# EasyEDA Pro project backup.epro, schematic SCH_3
Create Date: 2024-03-24; Page Name: P1; Project Name: ip2366; Schematic Name: SCH_3; Update Date: 2024-05-07; Drawed: luq; Page Size: A4; Version: V4.0
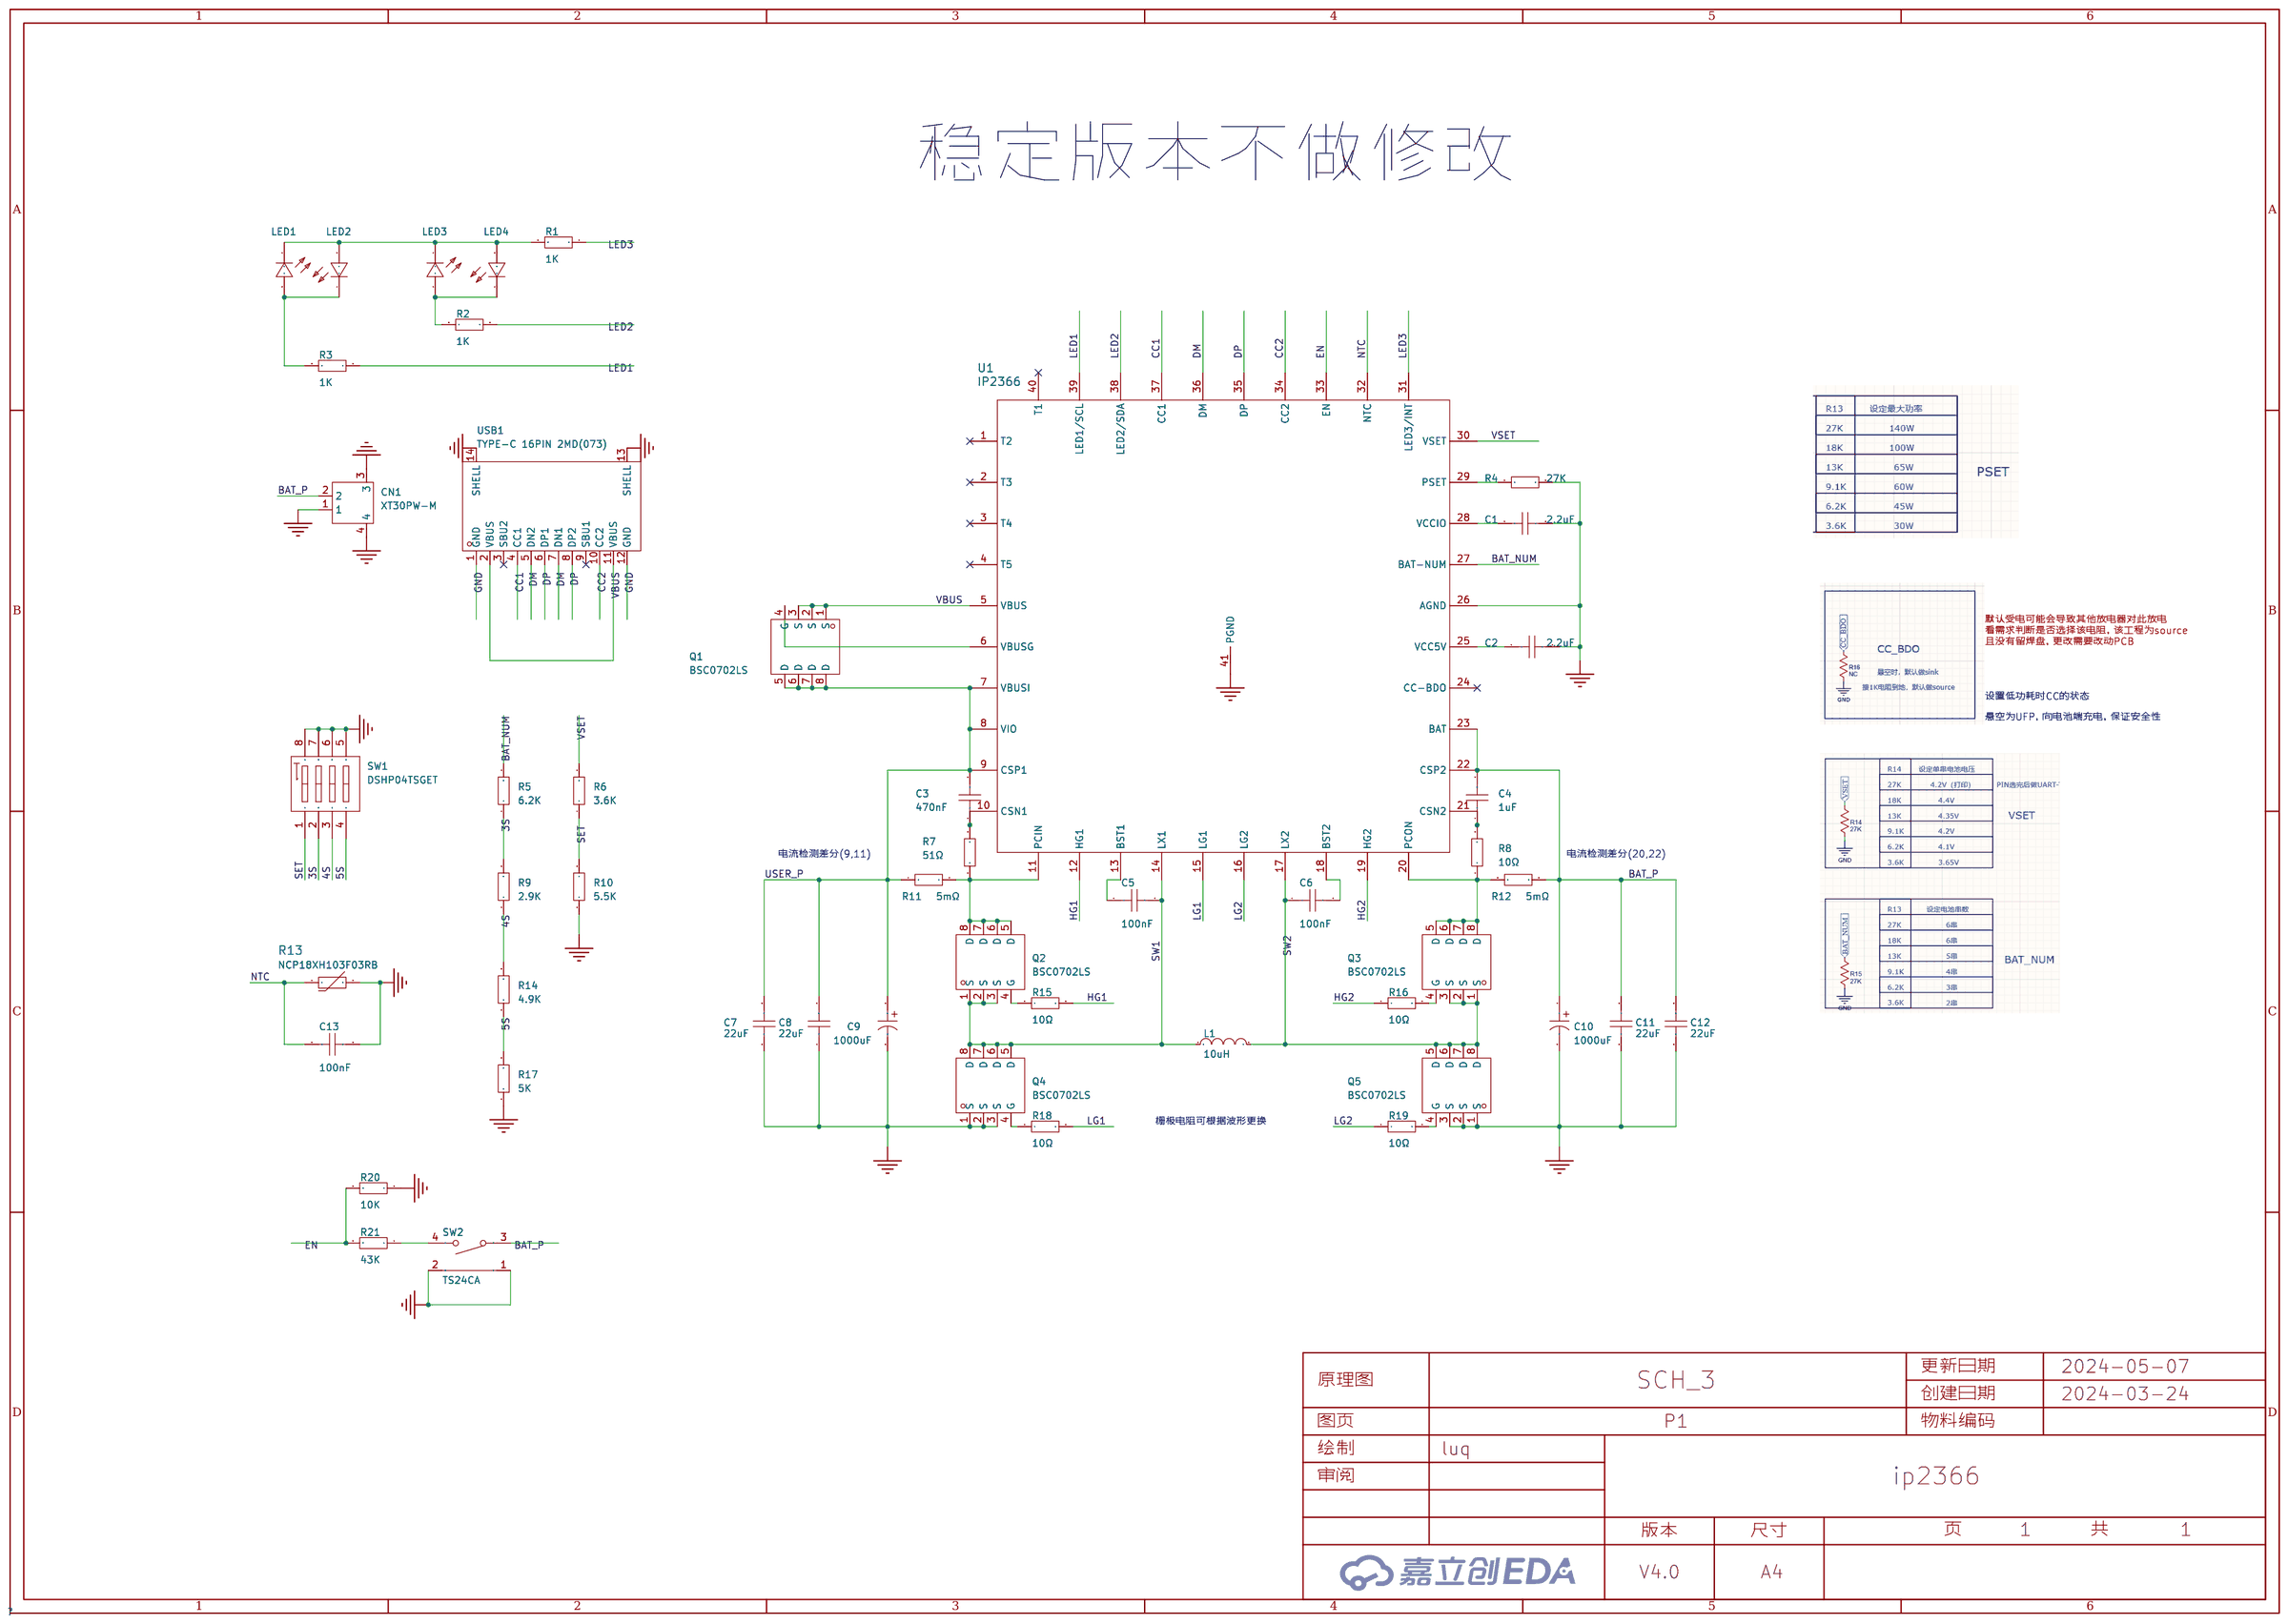
[diagram p3: schematic sheet]

## Parts
C1  2.2uF  [C0603]
C2  2.2uF  [C0603]
C3  470nF  [C0603]
C4  1uF  [C0603]
C5  100nF  [C0603]
C6  100nF  [C0603]
C7  22uF  [C1206]
C8  22uF  [C1206]
C9  1000uF  [CAP-TH_BD10.0-P5.00-D0.6-FD-A]
C10  1000uF  [CAP-TH_BD10.0-P5.00-D0.6-FD-A]
C11  22uF  [C1206]
C12  22uF  [C1206]
C13  100nF  [C0603]
CN1  XT30PW-M  [CONN-TH_XT30PW-M]
L1  10uH  [IND-SMD_L12.6-W13.5]
LED1  NCD0603R1  [LED0603-RD_RED]
LED2  NCD0603R1  [LED0603-RD_RED]
LED3  NCD0603R1  [LED0603-RD_RED]
LED4  NCD0603R1  [LED0603-RD_RED]
Q1  BSC0702LS  [PG-TDSON-8_L5.0-W6.0-P1.27-BL-EP]
Q2  BSC0702LS  [PG-TDSON-8_L5.0-W6.0-P1.27-BL-EP]
Q3  BSC0702LS  [PG-TDSON-8_L5.0-W6.0-P1.27-BL-EP]
Q4  BSC0702LS  [PG-TDSON-8_L5.0-W6.0-P1.27-BL-EP]
Q5  BSC0702LS  [PG-TDSON-8_L5.0-W6.0-P1.27-BL-EP]
R1  1K  [R0603]
R2  1K  [R0603]
R3  1K  [R0603]
R4  27K  [R0603]
R5  6.2K  [R0603]
R6  3.6K  [R0603]
R7  51Ω  [R0603]
R8  10Ω  [R0603]
R9  2.9K  [R0603]
R10  5.5K  [R0603]
R11  5mΩ  [R1206]
R12  5mΩ  [R1206]
R13  NCP18XH103F03RB  [R0603]
R14  4.9K  [R0603]
R15  10Ω  [R0603]
R16  10Ω  [R0603]
R17  5K  [R0603]
R18  10Ω  [R0603]
R19  10Ω  [R0603]
R20  10K  [R0603]
R21  43K  [R0603]
SW1  DSHP04TSGET  [SW-SMD_8P-L6.7-W5.4-P1.27-LS8.4]
SW2  TS24CA  [SW-SMD_TS24CA]
U1  IP2366  [IP2366]
USB1  TYPE-C 16PIN 2MD(073)  [USB-C-SMD_TYPE-C-6PIN-2MD-073]

## Library data of the parts
C1-C6 C13 = CAP_0603: Supplier Footprint: 0603
C7 C8 C11 C12 = C3216X5R1V226MTJ00E: 容值:22uF;精度:±20%;额定电压:35V;材质(温度系数):X5R;; LCSC Part Name: 22uF ±20% 35V; Supplier Part: C342620; Manufacturer: TDK; Supplier Footprint: 1206; JLCPCB Part Class: Extended Part; Datasheet: https://atta.szlcsc.com/upload/public/pdf/source/20190612/C361180_85CC9FB0751BEA97238DE56AB4AF0B1F.pdf; Supplier: LCSC; Tolerance: ±20%; Voltage Rated: 35V; Temperature Coefficient: X5R
C9 C10 = ZE11000UF35V119EC0014: 容值:1000uF;精度:±20%;额定电压:35V;纹波电流:6.2A@100kHz;等效串联电阻:8mΩ@100kHz;; LCSC Part Name: 1000uF ±20% 35V; Supplier Part: C2992586; Manufacturer: KNSCHA(科尼盛); Supplier Footprint: 插件,D10xL17mm; JLCPCB Part Class: 扩展库; Datasheet: https://atta.szlcsc.com/upload/public/pdf/source/20220418/57B24F92C08E224D784EAACECC03E503.pdf; Supplier: LCSC; Tolerance: ±20%; Rated Voltage: 35V; Ripple Current: 6.2A@100kHz; Equivalent Series Resistance(ESR): 8mΩ@100kHz; Lead Spacing: 5mm; φD: 10mm; L: 17mm; Lifetime @ Temp: 2000hrs@105℃; Operating Temperature: -40℃~+105℃
CN1 = XT30PW-M: 类别:-;类型1:-;; LCSC Part Name: AMASS(艾迈斯)航模插头 卧式弯脚 XT30PW-M公头; Supplier Part: C431092; Manufacturer: AMASS(艾迈斯); JLCPCB Part Class: 扩展库; Datasheet: https://atta.szlcsc.com/upload/public/pdf/source/20220222/6A9F22F7850E25B33E1BE430ADF8560B.pdf; Supplier: LCSC; Brand: 艾迈斯; Type: 航模插头; RatedVoltage: DC 500V; InterfaceType: 公头; RatedCurrent: 15A; RecommendedWireGauge: 16/18/20AWG; contact resistance: 1.2mΩ; specifications: 2pin
L1 = FXL1360-100-M: 电感值:10uH;精度:±20%;额定电流:10A;饱和电流(Isat):12.5A;类型:一体成型电感;; LCSC Part Name: 10uH ±20% 12.5A; Supplier Part: F; Manufacturer: cjiang(长江微电); Supplier Footprint: SMD,12.6x13.5mm; JLCPCB Part Class: 扩展库; Datasheet: https://atta.szlcsc.com/upload/public/pdf/source/20230516/EDBB5FB099B441B256CFB4945AE848AD.pdf; Supplier: LCSC; Tolerance: ±20%; Rated Current: 10A; Saturation Current (Isat): 12.5A; DC Resistance (DCR): 20.7mΩ; Type: 一体成型电感
LED1-LED4 = NCD0603R1_C84263: 灯头类型:-;发光颜色:红色;正向电压(VF):1.6V~2.6V;功率:65mW;正向电流:20mA;主波长:615nm~630nm;二极管配置:独立二极管;透镜颜色:无色透明透镜;色温:-;发光强度:80mcd~220mcd;发光角度:130°;载带方式:-;工作温度:-30℃~+85℃;; Supplier Part: C84263; Manufacturer: 国星光电; Supplier Footprint: 0603; JLCPCB Part Class: Extended Part; Datasheet: https://atta.szlcsc.com/upload/public/pdf/source/20200820/C84263_DABC6A75E58F576973B407FDBA283D60.pdf; Supplier: LCSC; Emitted Color: 红色; Forward Voltage (VF): 1.6V~2.6V; Power Dissipation: 65mW; Forward Current: 20mA; Dominant Wavelength: 615nm~630nm; Diode Configuration: 独立二极管; Lens Color: 无色透明透镜; Luminous Intensity: 80mcd~220mcd; Viewing Angle: 130°; Operating Temperature: -30℃~+85℃
Q1-Q5 = BSC0702LS: 类型:N沟道;漏源电压(Vdss):60V;连续漏极电流(Id):100A;功率(Pd):83W;导通电阻(RDS(on)@Vgs,Id):2.3mΩ@10V,50A;阈值电压(Vgs(th)@Id):2.3V@49uA;; LCSC Part Name: N沟道 耐压:60V 电流:100A; Supplier Part: C501503; Manufacturer: Infineon(英飞凌); Supplier Footprint: TDSON-8-EP(5x6); JLCPCB Part Class: 扩展库; Datasheet: https://atta.szlcsc.com/upload/public/pdf/source/20200324/C501503_BE3C55BAEEDCAD77F3934BFEE5415F86.pdf; Supplier: LCSC; Type: N沟道; Drain Source Voltage (Vdss): 60V; Continuous Drain Current (Id): 100A; Power Dissipation (Pd): 83W; Drain Source On Resistance (RDS(on)@Vgs,Id): 2.3mΩ@10V,50A; Gate Threshold Voltage (Vgs(th)@Id): 2.3V@49uA
R1-R10 R14-R21 = Res_0603: Supplier Footprint: 0603
R11 R12 = RLM12FTCMR005: 阻值:5mΩ;精度:±1%;功率:1W;温度系数:±100ppm/℃;; LCSC Part Name: 5mΩ ±1% 1W; Supplier Part: C316225; Manufacturer: 大毅科技; Supplier Footprint: 1206; JLCPCB Part Class: Extended Part; Datasheet: https://atta.szlcsc.com/upload/public/pdf/source/20181023/C316226_D363EC3D88B44FBEE1B74F4A1DF43EB9.pdf; Supplier: LCSC; Tolerance: ±1%; Power(Watts): 1W; Temperature Coefficient: ±100ppm/℃
R13 = NCP18XH103F03RB: 阻值(25℃):10kΩ;B值(25℃/50℃):3380K;电阻精度:±1%;功率:100mW;B值精度:±1%;最大稳态电流(25℃):310uA;; LCSC Part Name: 10kΩ 电阻精度:±1% 3380K; Supplier Part: C13564; Manufacturer: muRata(村田); Supplier Footprint: 0603; JLCPCB Part Class: 扩展库; Datasheet: https://atta.szlcsc.com/upload/public/pdf/source/20130819/1457706638081.pdf; Supplier: LCSC; Resistance @ 25℃: 10kΩ; B Constant (25℃/50℃): 3380K; Resistance Tolerance: ±1%; B Constant (25℃/85℃): 3434K; B Constant (25℃/100℃): 3455K; Power: 100mW; B Constant Tolerance: ±1%; Steady State Current (Max): 310uA; Operating Temperature: -40℃~+125℃
SW1 = DSHP04TSGET: 类型:平拨,凹槽式;电路结构:单刀单掷;开关位数:4位;使用寿命:-;颜色:黑色;; LCSC Part Name: 4位 1.27间距 拨码开关; Supplier Part: C40736; Manufacturer: YE; Supplier Footprint: SMD-8P,5.4x6.6mm; JLCPCB Part Class: 扩展库; Datasheet: https://atta.szlcsc.com/upload/public/pdf/source/20150928/1457707425288.pdf; Supplier: LCSC; Type: 平拨,凹槽式; Circuit: 单刀单掷; Number of Positions: 4位; Lead Pitch: 1.27mm; Color: 黑色
SW2 = TS24CA: 电路结构:单刀单掷;按钮形状:矩形按钮;安装方式:卧贴;开关长度:4.55mm;开关宽度:1.8mm;开关高度:3.5mm;触点电流:50mA;额定电压(DC):12V;带灯:-;机械寿命:-;; LCSC Part Name: 4.55*1.8*3.5mm 卧贴 轻触开关; Supplier Part: C393942; Manufacturer: SHOU HAN(首韩); Supplier Footprint: SMD; JLCPCB Part Class: 扩展库; Datasheet: https://atta.szlcsc.com/upload/public/pdf/source/20190521/C393942_591A9E318887EFA4274D34029981AD99.pdf; Supplier: LCSC; Circuit: 单刀单掷; Actuator Style: 矩形按钮; Mounting Style: 卧贴; Switch Length: 4.55mm; Switch Width: 1.8mm; Switch Height: 3.5mm; Contact Current: 50mA; Voltage Rating (DC): 12V
U1 = IP2366
USB1 = TYPE-C 16PIN 2MD(073): 连接器类型:Type-C;标准:-;公母:母;端口数量:1;触点数量:16P;安装方式:卧贴;额定电流 - 电源:5A;工作温度范围:-25℃~+85℃;; LCSC Part Name: Type-C 母 卧贴; Supplier Part: C2765186; Manufacturer: SHOU HAN(首韩); Supplier Footprint: SMD; JLCPCB Part Class: 扩展库; Datasheet: https://atta.szlcsc.com/upload/public/pdf/source/20211123/39B17C16241EAC15C5E277BDA434118E.pdf; Supplier: LCSC; Connector Type: Type-C; Gender: 母; Number of Ports: 1; Number of Contacts: 16P; Mounting Style: 卧贴; Current Rating - Power (Max): 5A; Operating Temperature Range: -25℃~+85℃

## Nets
GND: C1.2 C2.2 C7.1 C8.1 C9.2 C10.2 C11.1 C12.1 C13.2 CN1.1 CN1.3 CN1.4 Q4.1(S) Q4.2(S) Q4.3(S) Q5.1(S) Q5.2(S) Q5.3(S) R4.2 R10.1 R13.2 R17.1 R20.1 SW1.5(B4) SW1.6(B3) SW1.7(B2) SW1.8(B1) SW2.1 SW2.2 U1.26(AGND) U1.41(PGND) USB1.1(GND) USB1.12(GND) USB1.13(SHELL) USB1.14(SHELL)
VBUS: Q1.1(S) Q1.2(S) Q1.3(S) U1.5(VBUS) USB1.2(VBUS) USB1.11(VBUS)
3S: R5.1 R9.2 SW1.2(A2)
4S: R9.1 R14.2 SW1.3(A3)
5S: R14.1 R17.2 SW1.4(A4)
BAT_NUM: R5.2 U1.27(BAT-NUM)
BAT_P: C4.2 C10.1 C11.2 C12.2 CN1.2 R12.2 SW2.3 U1.22(CSP2) U1.23(BAT)
CC1: U1.37(CC1) USB1.4(CC1)
CC2: U1.34(CC2) USB1.10(CC2)
DM: U1.36(DM) USB1.5(DN2) USB1.7(DN1)
DP: U1.35(DP) USB1.6(DP1) USB1.8(DP2)
EN: R20.2 R21.2 U1.33(EN)
HG1: R15.2 U1.12(HG1)
HG2: R16.1 U1.19(HG2)
LED1: R3.1 U1.39(LED1/SCL)
LED2: R2.1 U1.38(LED2/SDA)
LED3: R1.1 U1.31(LED3/INT)
LG1: R18.2 U1.15(LG1)
LG2: R19.1 U1.16(LG2)
NTC: C13.1 R13.1 U1.32(NTC)
SET: R6.1 R10.2 SW1.1(A1)
SW1: C5.2 L1.1 Q2.1(S) Q2.2(S) Q2.3(S) Q4.5(D) Q4.6(D) Q4.7(D) Q4.8(D) U1.14(LX1)
SW2: C6.1 L1.2 Q3.1(S) Q3.2(S) Q3.3(S) Q5.5(D) Q5.6(D) Q5.7(D) Q5.8(D) U1.17(LX2)
USER_P: C3.2 C7.2 C8.2 C9.1 Q1.5(D) Q1.6(D) Q1.7(D) Q1.8(D) R11.1 U1.7(VBUSI) U1.8(VIO) U1.9(CSP1)
VSET: R6.2 U1.30(VSET)
$C1_1: C1.1 U1.28(VCCIO)
$C2_1: C2.1 U1.25(VCC5V)
$C3_1: C3.1 R7.2 U1.10(CSN1)
$C4_1: C4.1 R8.2 U1.21(CSN2)
$C5_1: C5.1 U1.13(BST1)
$C6_2: C6.2 U1.18(BST2)
$LED1_1: LED1.1(K) LED2.2(A) LED3.1(K) LED4.2(A) R1.2
$LED1_2: LED1.2(A) LED2.1(K) R3.2
$LED3_2: LED3.2(A) LED4.1(K) R2.2
$Q1_4: Q1.4(G) U1.6(VBUSG)
$Q2_4: Q2.4(G) R15.1
$Q2_5: Q2.5(D) Q2.6(D) Q2.7(D) Q2.8(D) R7.1 R11.2 U1.11(PCIN)
$Q3_4: Q3.4(G) R16.2
$Q3_5: Q3.5(D) Q3.6(D) Q3.7(D) Q3.8(D) R8.1 R12.1 U1.20(PCON)
$Q4_4: Q4.4(G) R18.1
$Q5_4: Q5.4(G) R19.2
$R4_1: R4.1 U1.29(PSET)
$R21_1: R21.1 SW2.4

Not connected (* = marked no-connect by the designer): U1 1(T2)* 2(T3)* 3(T4)* 4(T5)* 24(CC-BDO)* 40(T1)*; USB1 3(SBU2)* 9(SBU1)*

## Notes on the sheet
- 稳定版本不做修改
- 默认受电可能会导致其他放电器对此放电
  看需求判断是否选择该电阻，该工程为source
  且没有留焊盘，更改需要改动PCB
- 设置低功耗时CC的状态
- 悬空为UFP，向电池端充电，保证安全性
- 电流检测差分(9,11)
- 电流检测差分(20,22)
- 栅极电阻可根据波形更换
